# Altium schematic sheet Sensors.SchDoc
size A4; SheetNumber: 4; SheetTotal: 5
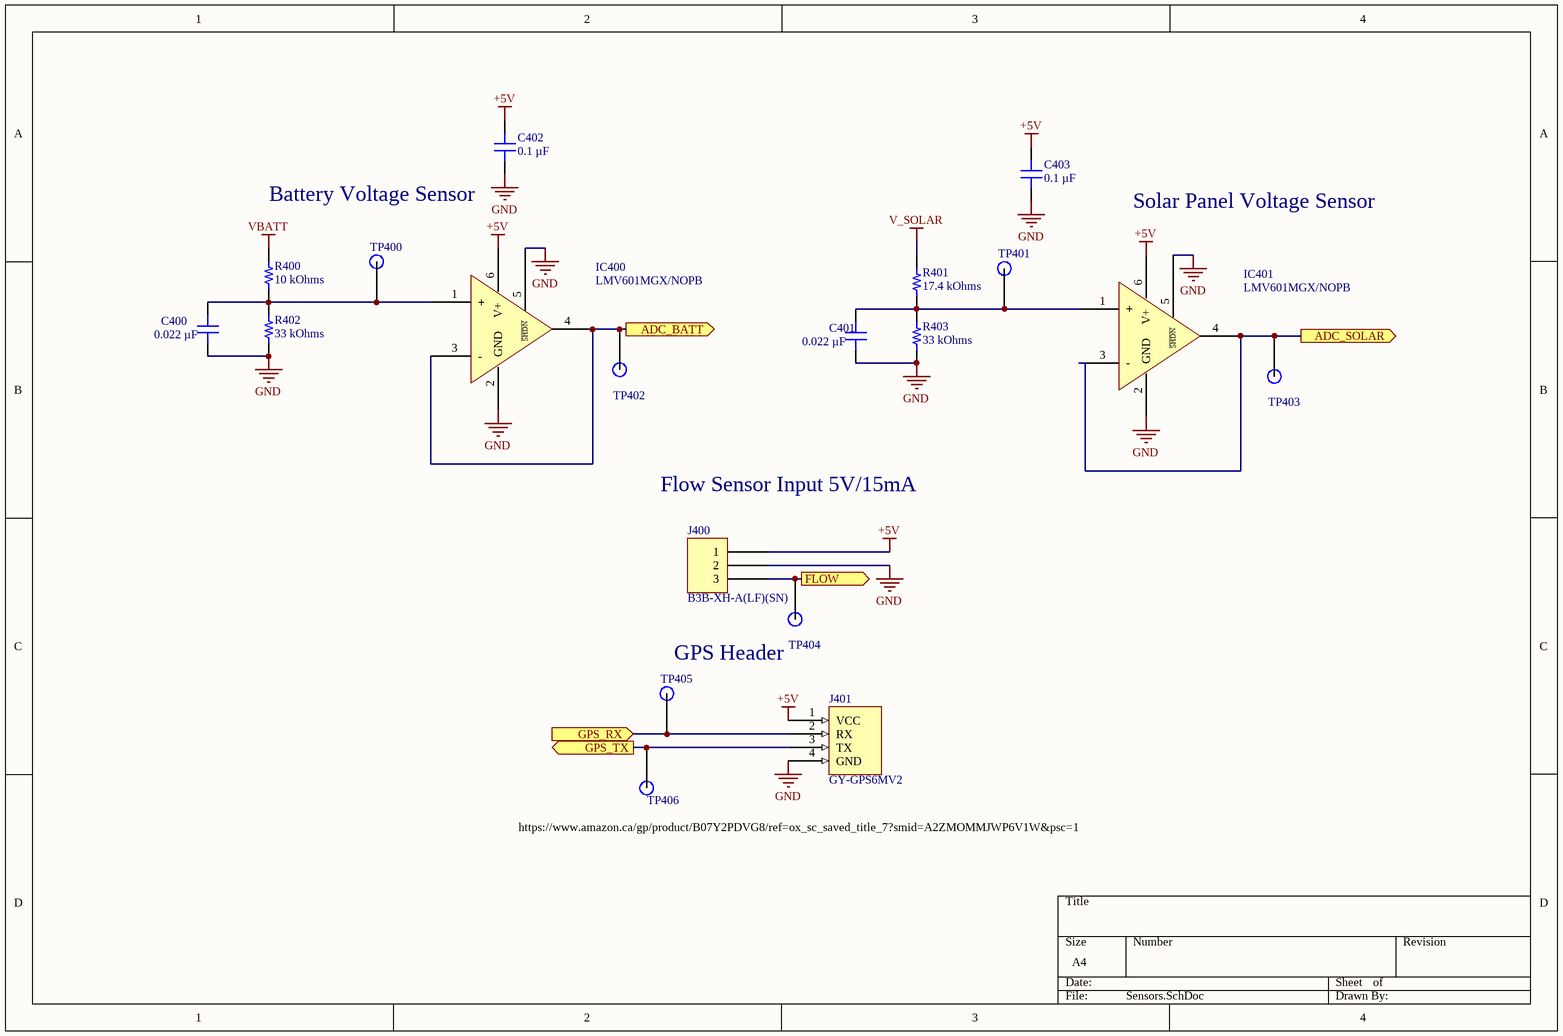
[diagram p0: Sensors.SchDoc]

## Parts
C400  0.022 µF  [CAP 0603_1608]
C401  0.022 µF  [CAP 0603_1608]
C402  0.1 µF  [CAP 0603_1608]
C403  0.1 µF  [CAP 0603_1608]
IC400  LMV601MGX/NOPB  [TI SC70-6 DCK]
IC401  LMV601MGX/NOPB  [TI SC70-6 DCK]
J400  B3B-XH-A(LF)(SN)  [JST XH B3B-XH-A]
J401  GY-GPS6MV2  [GY-GPS6MV2 -Footprint-1]
R400  10 kOhms  [RES 0603_1608]
R401  17.4 kOhms  [RES 0603_1608]
R402  33 kOhms  [RES 0603_1608]
R403  33 kOhms  [RES 0603_1608]
TP400  1.5mm Test Point  [1mm Test Point-Footprint-1]  (value not drawn)
TP401  1.5mm Test Point  [1mm Test Point-Footprint-1]  (value not drawn)
TP402  1.5mm Test Point  [1mm Test Point-Footprint-1]  (value not drawn)
TP403  1.5mm Test Point  [1mm Test Point-Footprint-1]  (value not drawn)
TP404  1.5mm Test Point  [1mm Test Point-Footprint-1]  (value not drawn)
TP405  1.5mm Test Point  [1mm Test Point-Footprint-1]  (value not drawn)
TP406  1.5mm Test Point  [1mm Test Point-Footprint-1]  (value not drawn)

## Ports
ADC_BATT (out), ADC_SOLAR (out), FLOW (out), GPS_RX (in), GPS_TX (out)

## Nets
+5V: C402.2 C403.2 IC400.6(V+) IC401.6(V+) J400.1 J401.1(VCC)
GND: C400.1 C401.1 C402.1 C403.1 IC400.2(GND) IC400.5(~{SHDN}) IC401.2(GND) IC401.5(~{SHDN}) J400.2 J401.4(GND) R402.1 R403.1
V_SOLAR: R401.2
VBATT: R400.2
ADC_BATT: IC400.3(-) IC400.4(OUT) TP402.1 ; port ADC_BATT
ADC_SOLAR: IC401.3(-) IC401.4(OUT) TP403.1 ; port ADC_SOLAR
FLOW: J400.3 TP404.1 ; port FLOW
GPS_RX: J401.2(RX) TP405.1 ; port GPS_RX
GPS_TX: J401.3(TX) TP406.1 ; port GPS_TX
NetC400_2: C400.2 IC400.1(+) R400.1 R402.2 TP400.1
NetC401_2: C401.2 IC401.1(+) R401.1 R403.2 TP401.1

## Notes on the sheet
- (near C402) Battery Voltage Sensor
- Solar Panel Voltage Sensor
- Flow Sensor Input 5V/15mA
- GPS Header
- (near TP406) https://www.amazon.ca/gp/product/B07Y2PDVG8/ref=ox_sc_saved_title_7?smid=A2ZMOMMJWP6V1W&psc=1

## Library data of the parts
C400 C401 = CC0603KRX7R7BB223: CAP CER 0.022UF 16V X7R 0603; manufacturer: Yageo; Tolerance: ±10%; Part Number: CC0603KRX7R7BB223; Value: 0.022 µF; Applications: General Purpose; Capacitance: 0.022 µF; componentlink1description: Datasheet; componentlink1url: https://www.yageo.com/upload/media/product/productsearch/datasheet/mlcc/UPY-GPHC_X7R_6.3V-to-50V_18.pdf; componentlink2description: DigiKey Link; componentlink2url: https://www.digikey.com/en/products/detail/yageo/CC0603KRX7R7BB223/5195208; Device Package: 0603 (1608 Metric); lastupdated: 2022-09-19 1:01:04 PM; Lifecycle Status: Active; Minimum Order: 1; Mounting Type: Surface Mount, MLCC; Operating Temperature: -55°C ~ 125°C; Package / Case: 0603 (1608 Metric); packaging: TapeAndReel; partid: 7845; Part Status: Active; price: 0.01; series: CC; Size / Dimension: 0.063" L x 0.031" W (1.60mm x 0.80mm); Supplier 1: DigiKey; Supplier Part Number 1: 311-1800-1-ND; Temperature Coefficient: X7R; Thickness (Max): 0.035" (0.90mm); Voltage - Rated: 16V
C402 C403 = C0603X104M3RAC7867: CAP CER 0.1UF 25V X7R 0603; manufacturer: KEMET; Tolerance: ±20%; Part Number: C0603X104M3RAC7867; Value: 0.1 µF; Applications: Boardflex Sensitive; Capacitance: 0.1 µF; componentlink1description: Datasheet; componentlink1url: https://api.kemet.com/component-edge/download/datasheet/C0603X104M3RACTU.pdf; componentlink2description: DigiKey Link; componentlink2url: https://www.digikey.com/en/products/detail/kemet/C0603X104M3RAC7867/2202613; Device Package: 0603 (1608 Metric); Features: Soft Termination; lastupdated: 2022-03-07 3:18:24 PM; Lifecycle Status: Active; Minimum Order: 1; Mounting Type: Surface Mount, MLCC; Operating Temperature: -55°C ~ 125°C; Package / Case: 0603 (1608 Metric); packaging: TapeAndReel; partid: 2484; Part Status: Active; price: 0.07; series: SMD Comm X7R Flex; Size / Dimension: 0.063" L x 0.031" W (1.60mm x 0.80mm); Supplier 1: DigiKey; Supplier Part Number 1: 399-13148-1-ND; Temperature Coefficient: X7R; Thickness (Max): 0.034" (0.87mm); Voltage - Rated: 25V
IC400 IC401 = LMV601MGX/NOPB: IC OPAMP GP 1 CIRCUIT SC70-6; Manufacturer: Texas Instruments; Amplifier Type: General Purpose; Current - Input Bias: 0.02pA; Current - Output / Channel: 113mA; Current - Supply: 107µA; Gain Bandwidth Product: 1MHz; Number of Circuits: 1; Output Type: Rail-to-Rail; Slew Rate: 1V/µs; Voltage - Input Offset: 250µV; Voltage - Supply, Single/Dual (±): 2.7V ~ 5.5V; Part Number: LMV601MGX/NOPB; ComponentLink1Description: Datasheet; ComponentLink1URL: http://www.ti.com/general/docs/suppproductinfo.tsp?distId=10&gotoUrl=http%3A%2F%2Fwww.ti.com%2Flit%2Fgpn%2Flmv601; ComponentLink2Description: DigiKey Link; ComponentLink2URL: http://digikey.com/product-detail/en/texas-instruments/LMV601MGX-NOPB/296-46438-1-ND/7033611; Device Package: 6-TSSOP, SC-88, SOT-363; LastUpdated: 2020-01-09 2:17:00 AM; Lifecycle Status: Active; Minimum Order: 1; Mounting Type: Surface Mount; Operating Temperature: -40°C ~ 125°C; Package / Case: 6-TSSOP, SC-88, SOT-363; Packaging: ReReel; PartId: 25; Part Status: Active; Price: 0.00; Series: -; Supplier 1: DigiKey; Supplier Part Number 1: 296-46438-1-ND; Supplier Device Package: SC-70-6
J400 = B3B-XH-A(LF)(SN): CONN HEADER VERT 3POS 2.5MM; Manufacturer: JST Sales America Inc.; Contact Length - Post: 0.134" (3.40mm); Current Rating (Amps): 3A; Material Flammability Rating: UL94 V-0; Number of Positions: 3; Number of Positions Loaded: All; Pitch - Mating: 0.098" (2.50mm); Shrouding: Shrouded - 4 Wall; Style: Board to Cable/Wire; Voltage Rating: 250V; Part Number: B3B-XH-A(LF)(SN); ComponentLink1Description: Datasheet; ComponentLink1URL: http://www.jst-mfg.com/product/pdf/eng/eXH.pdf; ComponentLink2Description: DigiKey Link; ComponentLink2URL: http://digikey.com/product-detail/en/jst-sales-america-inc/B3B-XH-A-LF-SN/455-2248-ND/1651046; Connector Type: Header; Contact Finish - Mating: Tin; Contact Finish - Post: Tin; Contact Material: Brass; Contact Shape: Square; Contact Type: Male Pin; Fastening Type: Detent Lock; Insulation Color: Natural; Insulation Height: 0.276" (7.00mm); Insulation Material: Polyamide (PA66), Nylon 6/6; LastUpdated: 2020-01-12 11:46:22 PM; Lifecycle Status: Active; Minimum Order: 1; Mounting Type: Through Hole; Number of Rows: 1; Operating Temperature: -25°C ~ 85°C; Packaging: Bulk; PartId: 68; Part Status: Active; Price: 0.19; Series: XH; Supplier 1: DigiKey; Supplier Part Number 1: 455-2248-ND; Termination: Press-Fit, Solder
J401 = CMP-00056-2: NEO-6M GPS Module
R400 = RT0603FRE0710KL: RES SMD 10K OHM 1% 1/10W 0603; Manufacturer: Yageo; Power (Watts): 0.1W, 1/10W; Temperature Coefficient: ±50ppm/°C; Part Number: RT0603FRE0710KL; Value: 10 kOhms; ComponentLink1Description: Datasheet; ComponentLink1URL: https://www.yageo.com/upload/media/product/productsearch/datasheet/rchip/PYu-RT_1-to-0.01_RoHS_L_11.pdf; ComponentLink2Description: DigiKey Link; ComponentLink2URL: http://digikey.com/product-detail/en/yageo/RT0603FRE0710KL/YAG2321CT-ND/5252435; Composition: Thin Film; Device Package: 0603 (1608 Metric); Height - Seated (Max): 0.022" (0.55mm); LastUpdated: 2022-03-07 3:35:56 PM; Lifecycle Status: Active; Minimum Order: 1; Number of Terminations: 2; Operating Temperature: -55°C ~ 155°C; Package / Case: 0603 (1608 Metric); Packaging: TapeAndReel; PartId: 5671; Part Status: Active; Price: 0.01; Resistance: 10 kOhms; Series: RT; Size / Dimension: 0.063" L x 0.031" W (1.60mm x 0.80mm); Supplier 1: DigiKey; Supplier Part Number 1: YAG2321CT-ND; Supplier Device Package: 0603; Tolerance: ±1%
R401 = RC0603FR-0717K4L: RES 17.4K OHM 1% 1/10W 0603; Manufacturer: Yageo; Power (Watts): 0.1W, 1/10W; Temperature Coefficient: ±100ppm/°C; Part Number: RC0603FR-0717K4L; Value: 17.4 kOhms; ComponentLink1Description: Datasheet; ComponentLink1URL: https://www.yageo.com/upload/media/product/productsearch/datasheet/rchip/PYu-RC_Group_51_RoHS_L_10.pdf; ComponentLink2Description: DigiKey Link; ComponentLink2URL: https://www.digikey.com/en/products/detail/yageo/RC0603FR-0717K4L/726981; Composition: Thick Film; Device Package: 0603 (1608 Metric); Features: Moisture Resistant; Height - Seated (Max): 0.022" (0.55mm); LastUpdated: 2022-09-19 1:22:24 PM; Lifecycle Status: Active; Minimum Order: 1; Number of Terminations: 2; Operating Temperature: -55°C ~ 155°C; Package / Case: 0603 (1608 Metric); Packaging: CutTape; PartId: 7526; Part Status: Active; Price: 0.01; Resistance: 17.4 kOhms; Series: RC_L; Size / Dimension: 0.063" L x 0.031" W (1.60mm x 0.80mm); Supplier 1: DigiKey; Supplier Part Number 1: 311-17.4KHRCT-ND; Supplier Device Package: 0603; Tolerance: ±1%
R402 R403 = RT0603FRE0733KL: RES SMD 33K OHM 1% 1/10W 0603; Manufacturer: Yageo; Power (Watts): 0.1W, 1/10W; Temperature Coefficient: ±50ppm/°C; Part Number: RT0603FRE0733KL; Value: 33 kOhms; ComponentLink1Description: Datasheet; ComponentLink1URL: https://www.yageo.com/upload/media/product/productsearch/datasheet/rchip/PYu-RT_1-to-0.01_RoHS_L_11.pdf; ComponentLink2Description: DigiKey Link; ComponentLink2URL: https://www.digikey.com/en/products/detail/yageo/RT0603FRE0733KL/1075313; Composition: Thin Film; Device Package: 0603 (1608 Metric); Height - Seated (Max): 0.022" (0.55mm); LastUpdated: 2022-09-19 1:22:31 PM; Lifecycle Status: Active; Minimum Order: 1; Number of Terminations: 2; Operating Temperature: -55°C ~ 155°C; Package / Case: 0603 (1608 Metric); Packaging: TapeAndReel; PartId: 5680; Part Status: Active; Price: 0.01; Resistance: 33 kOhms; Series: RT; Size / Dimension: 0.063" L x 0.031" W (1.60mm x 0.80mm); Supplier 1: DigiKey; Supplier Part Number 1: YAG5959CT-ND; Supplier Device Package: 0603; Tolerance: ±1%
TP400-TP406 = CMP-002-00006-1: 1.5mm Test Point 0.75mm hole size